# Altium schematic sheet Channel.SchDoc
size A
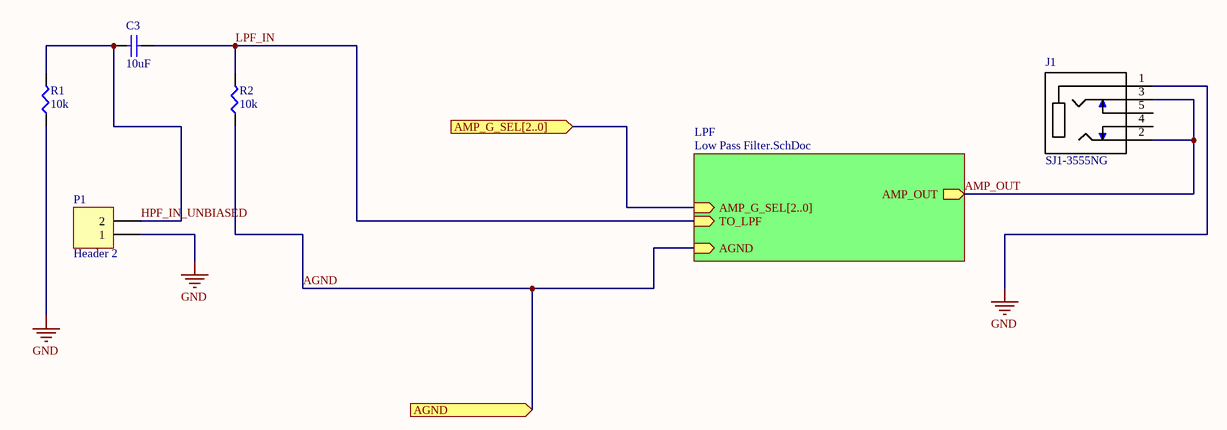
[diagram p0: Channel.SchDoc]

## Parts
C3  value 10uF  [C0805]  (hidden comment: Cap)
J1  SJ1-3555NG  [CUI_SJ1-3555NG]
P1  Header 2  [HDR1X2]
R1  10k  [SMD-0805-RES]
R2  10k  [SMD-0805-RES]

## Sub-sheets
LPF = Low Pass Filter.SchDoc: AMP_G_SEL[2..0] (in), TO_LPF (in), AMP_OUT (out), AGND (in)

## Ports
AGND (in), AMP_G_SEL[2..0] (in)

## Nets
GND: J1.1 P1.1 R1.1
AGND: R2.1 ; port AGND, sheet LPF/AGND
AMP_OUT: J1.2 J1.3 ; sheet LPF/AMP_OUT
HPF_IN_UNBIASED: C3.2 P1.2 R1.2
LPF_IN: C3.1 R2.2 ; sheet LPF/TO_LPF

Not connected (* = marked no-connect by the designer): J1 4 5

## Buses and harness runs
bus port AMP_G_SEL[2..0] = sheet LPF/AMP_G_SEL[2..0]

## Library data of the parts
C3 = Cap: Unpolarized Capacitor
P1 = Header 2: Header, 2-Pin; LatestRevisionDate: 17-Jul-2002; LatestRevisionNote: Re-released for DXP Platform.; Publisher: Altium Limited
R1 R2 = ERJ-6ENF1002V: RES SMD 10K OHM 1% 1/8W 0805; Manufacturer: Panasonic Electronic Components; Factory Stock: 0; Unit Price (USD): 0.00729; @ qty: 1500; Minimum Quantity: 1; Power (Watts): 0.125W, 1/8W; Temperature Coefficient: ±100ppm/°C; Part Number: ERJ-6ENF1002V; Datasheets: http://industrial.panasonic.com/www-cgi/jvcr13pz.cgi?E+PZ+3+AOA0002+ERJ6ENF1002V+7+WW; Image: //media.digikey.com/Renders/Panasonic%20Renders/ERJ-0805%20Pkg.jpg; Digi-Key Part Number: P10.0KCCT-ND; Quantity Available: 3985614; Packaging: Cut Tape (CT); Series: ERJ; Part Status: Active; Value: 10k; Tolerance: ±1%; Composition: Thick Film; Features: Automotive AEC-Q200; Operating Temperature: -55°C ~ 155°C; Package / Case: 0805 (2012 Metric); Supplier Device Package: 0805; Size / Dimension: 0.079" L x 0.049" W (2.00mm x 1.25mm); Height - Seated (Max): 0.028" (0.70mm); Number of Terminations: 2; Failure Rate: -
J1 = SJ1-3555NG: Value: *